# EAGLE schematic backplane (EAGLE 9.6.2)
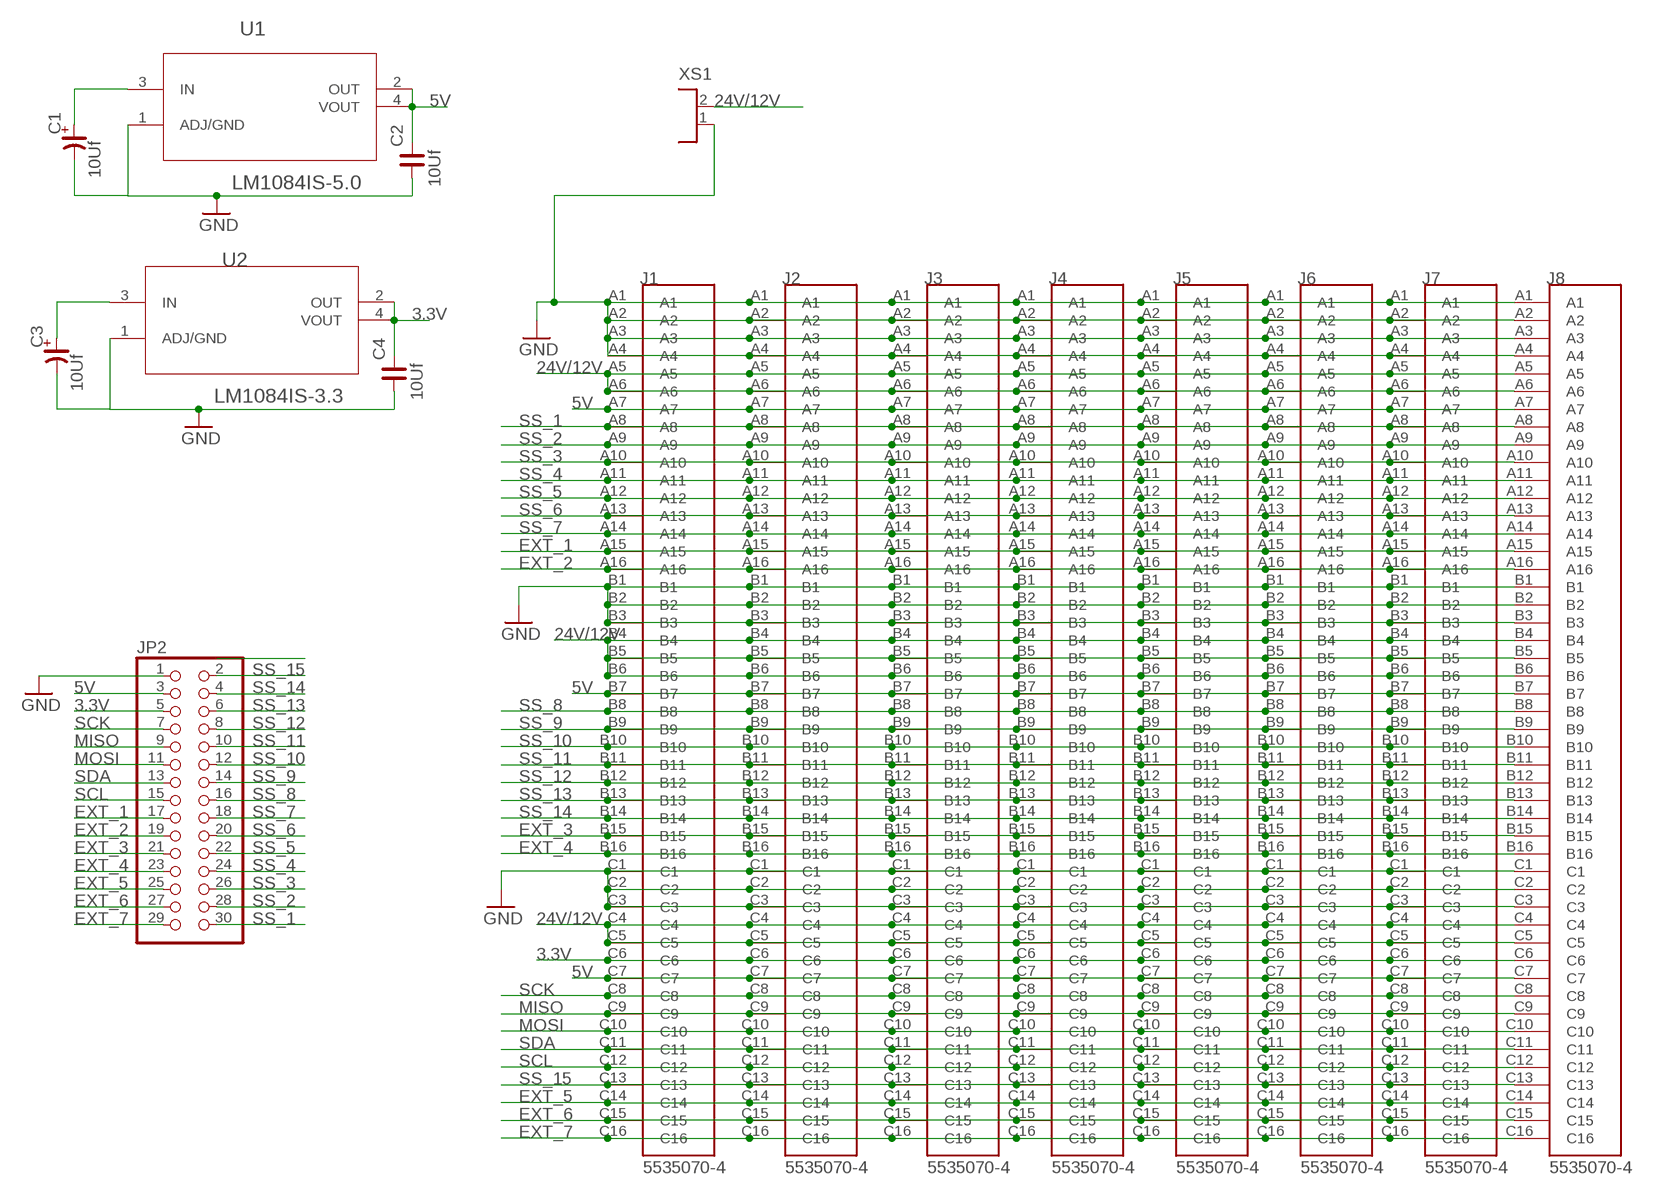
[diagram p0: schematic, sheet 1]

## Parts
C1  10Uf  CP_3216  [C3216/T]
C2  10Uf  C_1206  [C1206]
C3  10Uf  CP_3216  [C3216/T]
C4  10Uf  C_1206  [C1206]
J1  5535070-4  [TE_5535070-4]
J2  5535070-4  [TE_5535070-4]
J3  5535070-4  [TE_5535070-4]
J4  5535070-4  [TE_5535070-4]
J5  5535070-4  [TE_5535070-4]
J6  5535070-4  [TE_5535070-4]
J7  5535070-4  [TE_5535070-4]
J8  5535070-4  [TE_5535070-4]
JP2  PINHD-2X15  [2X15]
U1  LM1084IS-5.0  [TO254P1435X457-3N]
U2  LM1084IS-3.3  LM1084IS-5.0  [TO254P1435X457-3N]
XS1  2P  [DG55CB-2P-1]

## Nets
3.3V: C4.2 J1.C6 J2.C6 J3.C6 J4.C6 J5.C6 J6.C6 J7.C6 J8.C6 JP2.5 U2.2(OUT) U2.4(VOUT)
5V: C2.2 J1.A7 J1.B7 J1.C7 J2.A7 J2.B7 J2.C7 J3.A7 J3.B7 J3.C7 J4.A7 J4.B7 J4.C7 J5.A7 J5.B7 J5.C7 J6.A7 J6.B7 J6.C7 J7.A7 J7.B7 J7.C7 J8.A7 J8.B7 J8.C7 JP2.3 U1.2(OUT) U1.4(VOUT)
24V/12V: J1.A5 J1.A6 J1.B4 J1.B5 J1.B6 J1.C4 J1.C5 J2.A5 J2.A6 J2.B4 J2.B5 J2.B6 J2.C4 J2.C5 J3.A5 J3.A6 J3.B4 J3.B5 J3.B6 J3.C4 J3.C5 J4.A5 J4.A6 J4.B4 J4.B5 J4.B6 J4.C4 J4.C5 J5.A5 J5.A6 J5.B4 J5.B5 J5.B6 J5.C4 J5.C5 J6.A5 J6.A6 J6.B4 J6.B5 J6.B6 J6.C4 J6.C5 J7.A5 J7.A6 J7.B4 J7.B5 J7.B6 J7.C4 J7.C5 J8.A5 J8.A6 J8.B4 J8.B5 J8.B6 J8.C4 J8.C5 XS1.2
EXT_1: J1.A15 J2.A15 J3.A15 J4.A15 J5.A15 J6.A15 J7.A15 J8.A15 JP2.17
EXT_2: J1.A16 J2.A16 J3.A16 J4.A16 J5.A16 J6.A16 J7.A16 J8.A16 JP2.19
EXT_3: J1.B15 J2.B15 J3.B15 J4.B15 J5.B15 J6.B15 J7.B15 J8.B15 JP2.21
EXT_4: J1.B16 J2.B16 J3.B16 J4.B16 J5.B16 J6.B16 J7.B16 J8.B16 JP2.23
EXT_5: J1.C14 J2.C14 J3.C14 J4.C14 J5.C14 J6.C14 J7.C14 J8.C14 JP2.25
EXT_6: J1.C15 J2.C15 J3.C15 J4.C15 J5.C15 J6.C15 J7.C15 J8.C15 JP2.27
EXT_7: J1.C16 J2.C16 J3.C16 J4.C16 J5.C16 J6.C16 J7.C16 J8.C16 JP2.29
GND: C1.- C2.1 C3.- C4.1 J1.A1 J1.A2 J1.A3 J1.A4 J1.B1 J1.B2 J1.B3 J1.C1 J1.C2 J1.C3 J2.A1 J2.A2 J2.A3 J2.A4 J2.B1 J2.B2 J2.B3 J2.C1 J2.C2 J2.C3 J3.A1 J3.A2 J3.A3 J3.A4 J3.B1 J3.B2 J3.B3 J3.C1 J3.C2 J3.C3 J4.A1 J4.A2 J4.A3 J4.A4 J4.B1 J4.B2 J4.B3 J4.C1 J4.C2 J4.C3 J5.A1 J5.A2 J5.A3 J5.A4 J5.B1 J5.B2 J5.B3 J5.C1 J5.C2 J5.C3 J6.A1 J6.A2 J6.A3 J6.A4 J6.B1 J6.B2 J6.B3 J6.C1 J6.C2 J6.C3 J7.A1 J7.A2 J7.A3 J7.A4 J7.B1 J7.B2 J7.B3 J7.C1 J7.C2 J7.C3 J8.A1 J8.A2 J8.A3 J8.A4 J8.B1 J8.B2 J8.B3 J8.C1 J8.C2 J8.C3 JP2.1 U1.1(ADJ/GND) U2.1(ADJ/GND) XS1.1
MISO: J1.C9 J2.C9 J3.C9 J4.C9 J5.C9 J6.C9 J7.C9 J8.C9 JP2.9
MOSI: J1.C10 J2.C10 J3.C10 J4.C10 J5.C10 J6.C10 J7.C10 J8.C10 JP2.11
N$1: C3.+ U2.3(IN)
N$2: C1.+ U1.3(IN)
SCK: J1.C8 J2.C8 J3.C8 J4.C8 J5.C8 J6.C8 J7.C8 J8.C8 JP2.7
SCL: J1.C12 J2.C12 J3.C12 J4.C12 J5.C12 J6.C12 J7.C12 J8.C12 JP2.15
SDA: J1.C11 J2.C11 J3.C11 J4.C11 J5.C11 J6.C11 J7.C11 J8.C11 JP2.13
SS_1: J1.A8 J2.A8 J3.A8 J4.A8 J5.A8 J6.A8 J7.A8 J8.A8 JP2.30
SS_2: J1.A9 J2.A9 J3.A9 J4.A9 J5.A9 J6.A9 J7.A9 J8.A9 JP2.28
SS_3: J1.A10 J2.A10 J3.A10 J4.A10 J5.A10 J6.A10 J7.A10 J8.A10 JP2.26
SS_4: J1.A11 J2.A11 J3.A11 J4.A11 J5.A11 J6.A11 J7.A11 J8.A11 JP2.24
SS_5: J1.A12 J2.A12 J3.A12 J4.A12 J5.A12 J6.A12 J7.A12 J8.A12 JP2.22
SS_6: J1.A13 J2.A13 J3.A13 J4.A13 J5.A13 J6.A13 J7.A13 J8.A13 JP2.20
SS_7: J1.A14 J2.A14 J3.A14 J4.A14 J5.A14 J6.A14 J7.A14 J8.A14 JP2.18
SS_8: J1.B8 J2.B8 J3.B8 J4.B8 J5.B8 J6.B8 J7.B8 J8.B8 JP2.16
SS_9: J1.B9 J2.B9 J3.B9 J4.B9 J5.B9 J6.B9 J7.B9 J8.B9 JP2.14
SS_10: J1.B10 J2.B10 J3.B10 J4.B10 J5.B10 J6.B10 J7.B10 J8.B10 JP2.12
SS_11: J1.B11 J2.B11 J3.B11 J4.B11 J5.B11 J6.B11 J7.B11 J8.B11 JP2.10
SS_12: J1.B12 J2.B12 J3.B12 J4.B12 J5.B12 J6.B12 J7.B12 J8.B12 JP2.8
SS_13: J1.B13 J2.B13 J3.B13 J4.B13 J5.B13 J6.B13 J7.B13 J8.B13 JP2.6
SS_14: J1.B14 J2.B14 J3.B14 J4.B14 J5.B14 J6.B14 J7.B14 J8.B14 JP2.4
SS_15: J1.C13 J2.C13 J3.C13 J4.C13 J5.C13 J6.C13 J7.C13 J8.C13 JP2.2

## Library data of the parts
C1 C3 = rc-master-smd:CP_: POLARIZED CAP
C2 C4 = rc-master-smd:C_: NON-POLARIZED CAP
J1-J8 = 5535070-4:5535070-4: Check prices <https://pricing.snapeda.com/parts/5535070-4/TE%20Connectivity/view-part?ref=eda>; AVAILABILITY: In Stock; CENTERLINE_PITCH: 2.54 mm[.1 in]; COMMENT: 5535070-4; DESCRIPTION: Conn DIN 41612 RCP 48 POS 2.54mm Solder ST Thru-Hole; MF: TE Connectivity; MP: 5535070-4; NUMBER_OF_POSITIONS: 48; PACKAGE: None; PRICE: None; PURCHASE-URL: https://pricing.snapeda.com/search/part/5535070-4/?ref=eda
JP2 = pinhead:PINHD-2X15: PIN HEADER
U1 U2 = LM1084IS-5.0:LM1084IS-5.0: Low Dropout Positive Regulators Check prices <https://pricing.snapeda.com/parts/LM1084IS-5.0/Texas%20Instruments/view-part?ref=eda>; AVAILABILITY: In Stock; DESCRIPTION: LDO Regulator Pos 5V 5A 4-Pin(3+Tab) TO-263 Tube; MF: Texas Instruments; MP: LM1084IS-5.0; PACKAGE: TO-263 Texas Instruments; PRICE: None; PURCHASE-URL: https://pricing.snapeda.com/search/part/LM1084IS-5.0/?ref=eda
XS1 = con-dg55:2P: DEGSON DG55 CONNECTOR